# EAGLE design dual.vca.main (EAGLE 9.6.2)
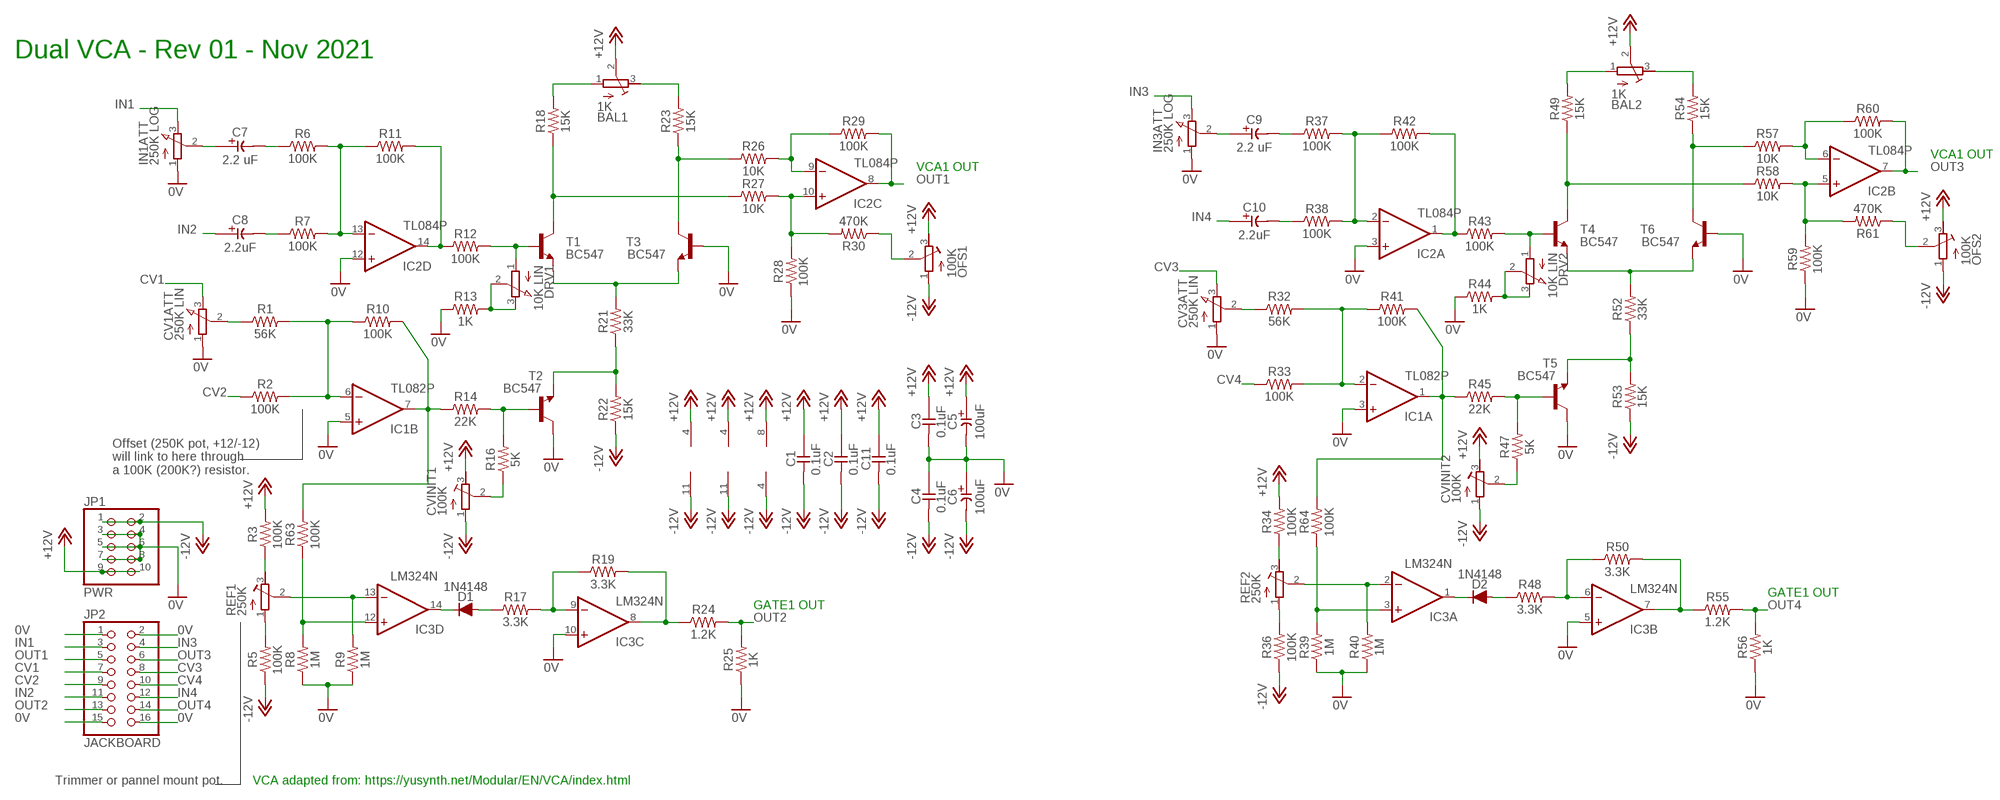
[diagram p0: schematic, sheet 1]

## Parts
BAL1  1K  R-TRIMM3339P  [RTRIM3339P]
BAL2  1K  R-TRIMM3339P  [RTRIM3339P]
C1  0.1uF  CC-US025-024X044  [C025-024X044]
C2  0.1uF  CC-US025-024X044  [C025-024X044]
C3  0.1uF  CC-US025-024X044  [C025-024X044]
C4  0.1uF  CC-US025-024X044  [C025-024X044]
C5  100uF  CE-USE5-8.5  [E5-8,5]
C6  100uF  CE-USE5-8.5  [E5-8,5]
C7  2.2 uF  CE-USE2-5  [E2-5]
C8  2.2uF  CE-USE2-5  [E2-5]
C9  2.2 uF  CE-USE2-5  [E2-5]
C10  2.2uF  CE-USE2-5  [E2-5]
C11  0.1uF  CC-US025-024X044  [C025-024X044]
CV1ATT  250K LIN  3RP/1610N  [3RP/1610N]
CV3ATT  250K LIN  3RP/1610N  [3RP/1610N]
CVINIT1  100K  R-TRIMM3339P  [RTRIM3339P]
CVINIT2  100K  R-TRIMM3339P  [RTRIM3339P]
D1  1N4148  [DO34-5]
D2  1N4148  [DO34-5]
DRV1  10K LIN  3RP/1610N  [3RP/1610N]
DRV2  10K LIN  3RP/1610N  [3RP/1610N]
IC1  TL082P  [DIL08]
IC2  TL084P  [DIL14]
IC3  LM324N  [DIL14]
IN1ATT  250K LOG  3RP/1610N  [3RP/1610N]
IN3ATT  250K LOG  3RP/1610N  [3RP/1610N]
JP1  PWR  PINHD-2X5  [2X05]
JP2  JACKBOARD  PINHD-2X8  [2X08]
OFS1  100K  R-TRIMM3339P  [RTRIM3339P]
OFS2  100K  R-TRIMM3339P  [RTRIM3339P]
R1  56K  R  [0207/7]
R2  100K  R  [0207/7]
R3  100K  R  [0207/7]
R5  100K  R  [0207/7]
R6  100K  R  [0207/7]
R7  100K  R  [0207/7]
R8  1M  R  [0207/7]
R9  1M  R  [0207/7]
R10  100K  R  [0207/7]
R11  100K  R  [0207/7]
R12  100K  R  [0207/7]
R13  1K  R  [0207/7]
R14  22K  R  [0207/7]
R16  5K  R  [0207/7]
R17  3.3K  R  [0207/7]
R18  15K  R  [0207/7]
R19  3.3K  R  [0207/7]
R21  33K  R  [0207/7]
R22  15K  R  [0207/7]
R23  15K  R  [0207/7]
R24  1.2K  R  [0207/7]
R25  1K  R  [0207/7]
R26  10K  R  [0207/7]
R27  10K  R  [0207/7]
R28  100K  R  [0207/7]
R29  100K  R  [0207/7]
R30  470K  R  [0207/7]
R32  56K  R  [0207/7]
R33  100K  R  [0207/7]
R34  100K  R  [0207/7]
R36  100K  R  [0207/7]
R37  100K  R  [0207/7]
R38  100K  R  [0207/7]
R39  1M  R  [0207/7]
R40  1M  R  [0207/7]
R41  100K  R  [0207/7]
R42  100K  R  [0207/7]
R43  100K  R  [0207/7]
R44  1K  R  [0207/7]
R45  22K  R  [0207/7]
R47  5K  R  [0207/7]
R48  3.3K  R  [0207/7]
R49  15K  R  [0207/7]
R50  3.3K  R  [0207/7]
R52  33K  R  [0207/7]
R53  15K  R  [0207/7]
R54  15K  R  [0207/7]
R55  1.2K  R  [0207/7]
R56  1K  R  [0207/7]
R57  10K  R  [0207/7]
R58  10K  R  [0207/7]
R59  100K  R  [0207/7]
R60  100K  R  [0207/7]
R61  470K  R  [0207/7]
R63  100K  R  [0207/7]
R64  100K  R  [0207/7]
REF1  250K  R-TRIMM3339P  [RTRIM3339P]
REF2  250K  R-TRIMM3339P  [RTRIM3339P]
T1  BC547  [TO92]
T2  BC547  [TO92]
T3  BC547  [TO92]
T4  BC547  [TO92]
T5  BC547  [TO92]
T6  BC547  [TO92]

## Nets
0V [pwr]: C3.2 C4.1 C5.- C6.+ CV1ATT.1(A) CV3ATT.1(A) IC1.3(A:+IN) IC1.5(B:+IN) IC2.3(A:+IN) IC2.12(D:+IN) IC3.5(B:+IN) IC3.10(C:+IN) IN1ATT.1(A) IN3ATT.1(A) JP1.3 JP1.4 JP1.5 JP1.6 JP1.7 JP1.8 JP2.1 JP2.2 JP2.15 JP2.16 R8.1 R9.1 R13.1 R25.1 R28.1 R39.1 R40.1 R44.1 R56.1 R59.1 T2.3(C) T3.2(B) T5.3(C) T6.2(B)
+12V [pwr]: BAL1.2(S) BAL2.2(S) C1.1 C2.1 C3.1 C5.+ C11.1 CVINIT1.3(E) CVINIT2.3(E) IC1.8(P:V+) IC2.4(P:V+) IC3.4(P:V+) JP1.9 JP1.10 OFS1.3(E) OFS2.3(E) R3.2 R34.2
-12V [pwr]: C1.2 C2.2 C4.2 C6.- C11.2 CVINIT1.1(A) CVINIT2.1(A) IC1.4(P:V-) IC2.11(P:V-) IC3.11(P:V-) JP1.1 JP1.2 OFS1.1(A) OFS2.1(A) R5.1 R22.1 R36.1 R53.1
CV1: CV1ATT.3(E) JP2.7
CV2: JP2.9 R2.1
CV3: CV3ATT.3(E) JP2.8
CV4: JP2.10 R33.1
IN1: IN1ATT.3(E) JP2.3
IN2: C8.+ JP2.11
IN3: IN3ATT.3(E) JP2.4
IN4: C10.+ JP2.12
N$1: IC2.13(D:-IN) R6.2 R7.2 R11.1
N$2: IC2.9(C:-IN) R26.2 R29.1
N$3: IC2.14(D:OUT) R11.2 R12.1
N$4: DRV1.1(A) R12.2 T1.2(B)
N$5: R18.1 R27.1 T1.3(C)
N$6: BAL1.1(A) R18.2
N$7: BAL1.3(E) R23.2
N$8: R23.1 R26.1 T3.3(C)
N$9: R21.2 T1.1(E) T3.1(E)
N$10: OFS1.2(S) R30.1
N$11: C7.- R6.1
N$12: IC2.10(C:+IN) R27.2 R28.2 R30.2
N$13: R21.1 R22.2 T2.1(E)
N$14: C8.- R7.1
N$15: R14.2 R16.2 T2.2(B)
N$16: CVINIT1.2(S) R16.1
N$17: IC1.7(B:OUT) R10.2 R14.1 R63.2
N$18: IC3.13(D:-IN) R9.2 REF1.2(S)
N$19: IC1.6(B:-IN) R1.2 R2.2 R10.1
N$20: R3.1 REF1.3(E)
N$21: R5.2 REF1.1(A)
N$22: D1.C IC3.14(D:OUT)
N$23: D1.A R17.1
N$24: IC3.9(C:-IN) R17.2 R19.1
N$25: IC3.8(C:OUT) R19.2 R24.1
N$26: DRV2.2(S) DRV2.3(E) R44.2
N$27: C7.+ IN1ATT.2(S)
N$28: IC2.2(A:-IN) R37.2 R38.2 R42.1
N$29: CV1ATT.2(S) R1.1
N$30: IC2.1(A:OUT) R42.2 R43.1
N$31: R49.1 R58.1 T4.3(C)
N$32: BAL2.1(A) R49.2
N$33: BAL2.3(E) R54.2
N$34: R54.1 R57.1 T6.3(C)
N$35: R52.2 T4.1(E) T6.1(E)
N$36: IC2.6(B:-IN) R57.2 R60.1
N$37: IC2.5(B:+IN) R58.2 R59.2 R61.2
N$38: OFS2.2(S) R61.1
N$39: R52.1 R53.2 T5.1(E)
N$40: R45.2 R47.2 T5.2(B)
N$41: CVINIT2.2(S) R47.1
N$42: IC1.1(A:OUT) R41.2 R45.1 R64.2
N$43: IC1.2(A:-IN) R32.2 R33.2 R41.1
N$44: C9.- R37.1
N$45: C10.- R38.1
N$46: IC3.3(A:+IN) R39.2 R64.1
N$47: R34.1 REF2.3(E)
N$48: R36.2 REF2.1(A)
N$49: D2.C IC3.1(A:OUT)
N$50: D2.A R48.1
N$51: IC3.6(B:-IN) R48.2 R50.1
N$52: IC3.7(B:OUT) R50.2 R55.1
N$53: DRV2.1(A) R43.2 T4.2(B)
N$54: DRV1.2(S) DRV1.3(E) R13.2
N$55: C9.+ IN3ATT.2(S)
N$56: CV3ATT.2(S) R32.1
N$57: IC3.12(D:+IN) R8.2 R63.1
N$58: IC3.2(A:-IN) R40.2 REF2.2(S)
OUT1: IC2.8(C:OUT) JP2.5 R29.2
OUT2: JP2.13 R24.2 R25.2
OUT3: IC2.7(B:OUT) JP2.6 R60.2
OUT4: JP2.14 R55.2 R56.2

## Notes on the sheet
- Dual VCA - Rev 01 - Nov 2021
- VCA1 OUT
- VCA1 OUT
- Offset (250K pot, +12/-12)
  will link to here through 
  a 100K (200K?) resistor.
- GATE1 OUT
- GATE1 OUT
- Trimmer or pannel mount pot. | VCA adapted from: https://yusynth.net/Modular/EN/VCA/index.html

## Library data of the parts
BAL1 BAL2 CVINIT1 CVINIT2 OFS1 OFS2 REF1 REF2 = rcl:R-TRIMM: Trimm resistor; SPICEMODEL: X; SPICEPREFIXL: POT
C1-C4 C11 = _common:CC-US: CAPACITOR, US symbol
C5-C10 = _common:CE-US: ELECTROLYTIC CAPACITOR, US symbol
CV1ATT CV3ATT DRV1 DRV2 IN1ATT IN3ATT = _common:3RP/1610N: Generic single level pcb pot.
D1 D2 = _common:1N4148: DIODE high speed (Philips)
IC1 = linear:TL082: OP AMP Data sheet <http://www.ti.com/lit/ds/symlink/tl084a . pdf>; DATA_SHEET: <a href="http://www.ti.com/lit/ds/symlink/tl084a.pdf"> Data sheet </a>
IC2 = linear:TL084: OP AMP
IC3 = linear:LM324: OP AMP
JP1 = pinhead:PINHD-2X5: PIN HEADER
JP2 = pinhead:PINHD-2X8: PIN HEADER
R1-R3 R5-R14 R16-R19 R21-R30 R32-R34 R36-R45 R47-R50 R52-R61 R63 R64 = _common:R: RESISTOR, US symbol
T1-T6 = transistor:BC547: NPN TRANSISTOR

## Net classes
0 default: width 0.406 mm, clearance 0.305 mm
1 pwr: width 0.813 mm, clearance 0.406 mm to class 0, clearance 0.406 mm

## Board
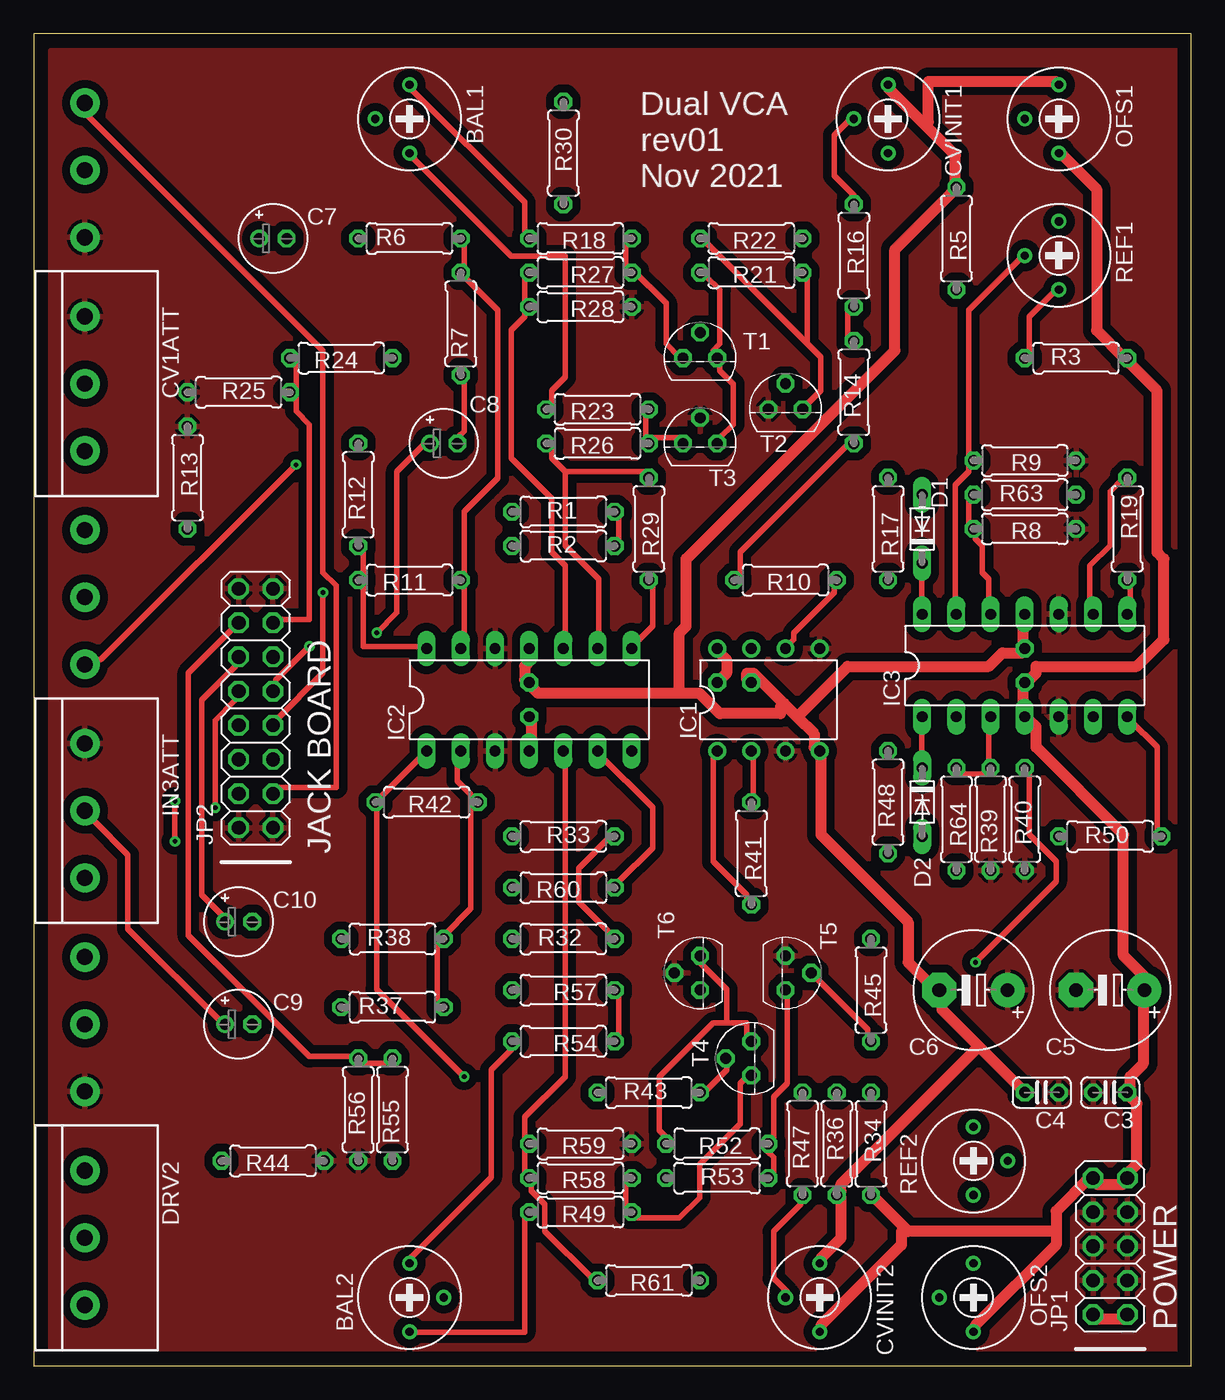
[diagram p1: board, top side]
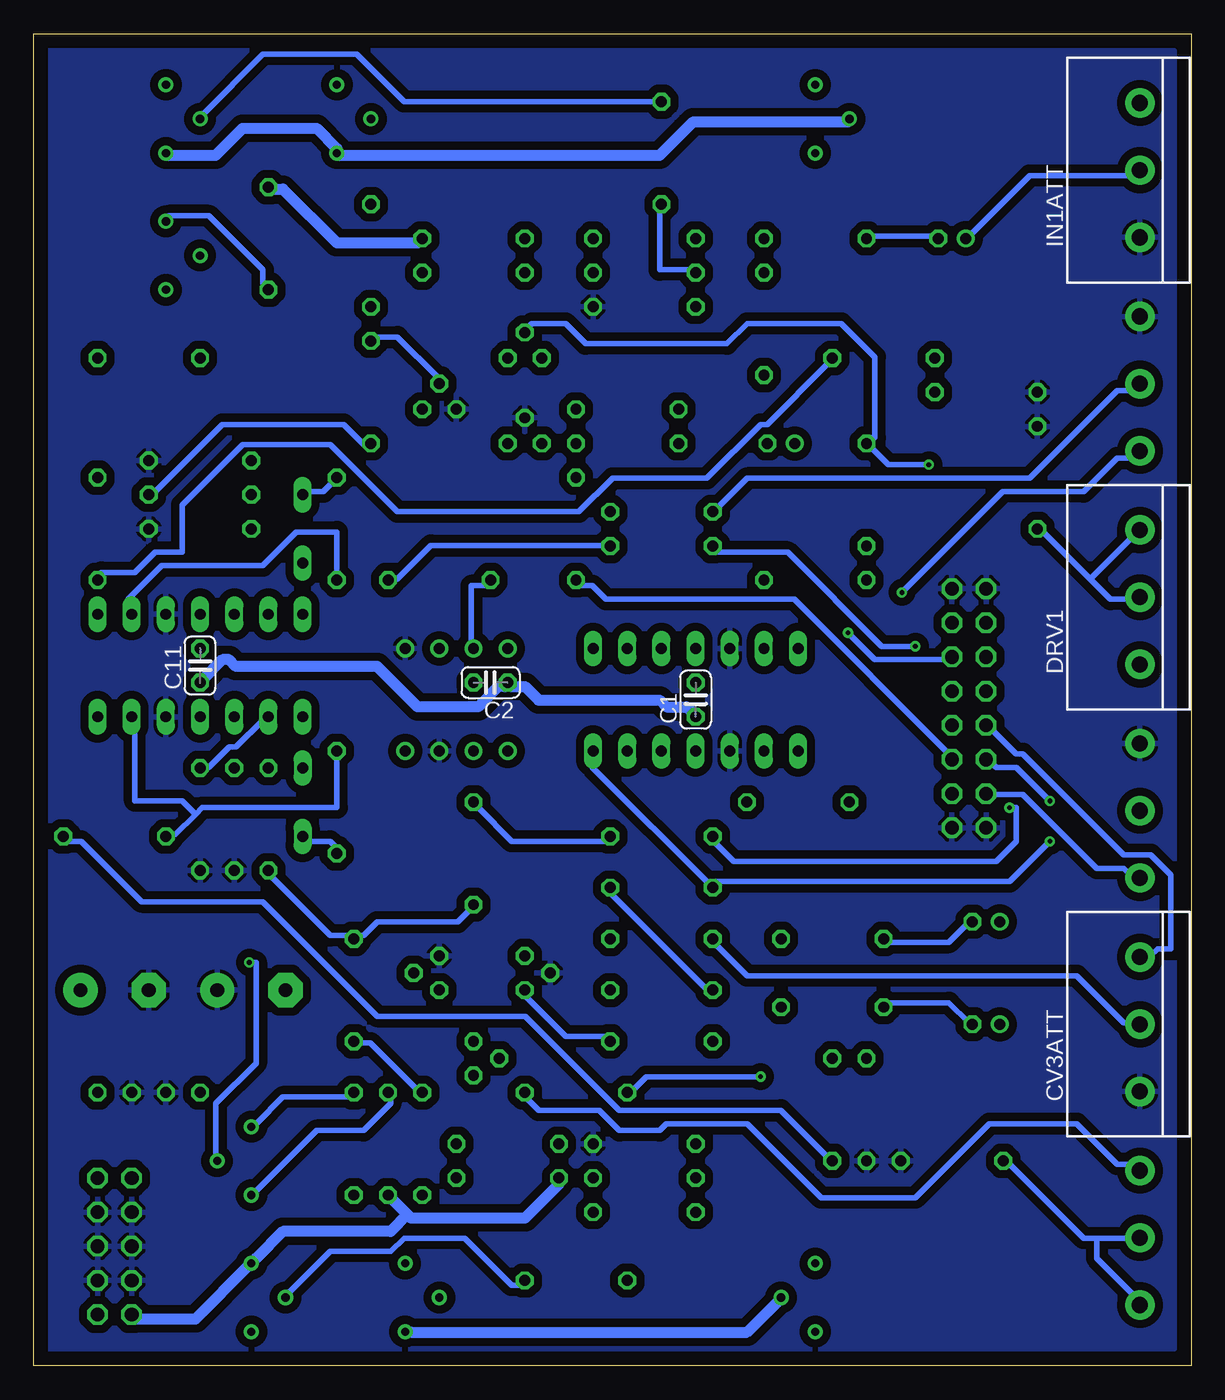
[diagram p2: board, bottom side, seen from below]

Size 86.03 x 99.05 mm. Coordinates in mm from the lower left corner, seen from the top.
Outline: 0,0 86.03,0 86.03,99.05 0,99.05 0,0
Copper layers (1*16): Top 0.035mm / dielectric 1.5mm / Bottom 0.035mm
Design rules "default": minimum track width 6mil, minimum drill 0.35mm, track to track 6mil, track to pad 6mil, pad to pad 6mil, via to via 6mil, smd to smd 6mil, copper to edge 40mil, drill to drill 6mil, minimum pad ring 10mil, minimum via ring 8mil, stop-mask expansion 4mil, vias tented up to drill 0mil, thermal gap 10mil

### Footprints (pad centres in the part's own frame; a part is rotated, then mirrored left to right if it is on the bottom)
RTRIM3339P = drill 0.61: 1 -2.54,0; 2 0,-2.54; 3 2.54,0
C025-024X044 = drill 0.813 octagon: 1 -1.27,0; 2 1.27,0
E5-8,5 = drill 1.016 pad 2.54: + -2.54,0 | drill 1.016 pad 2.54 octagon: - 2.54,0
E2-5 = drill 0.813 pad 1.27: + -1.016,0 | drill 0.813 pad 1.27 octagon: - 1.016,0
3RP/1610N = drill 1.2 pad 2.184: 1 -5,0; 2 0,0; 3 5,0
DO34-5 = drill 0.813 long: A 2.54,0; C -2.54,0
DIL08 = drill 0.813 pad 1.27: 1 -3.81,-3.81; 2 -1.27,-3.81; 3 1.27,-3.81; 4 3.81,-3.81; 5 3.81,3.81; 6 1.27,3.81; 7 -1.27,3.81; 8 -3.81,3.81
DIL14 = drill 0.813 long: 1 -7.62,-3.81; 2 -5.08,-3.81; 3 -2.54,-3.81; 4 0,-3.81; 5 2.54,-3.81; 6 5.08,-3.81; 7 7.62,-3.81; 8 7.62,3.81; 9 5.08,3.81; 10 2.54,3.81; 11 0,3.81; 12 -2.54,3.81; 13 -5.08,3.81; 14 -7.62,3.81
2X05 = drill 1.016 octagon: 1 -5.08,-1.27; 2 -5.08,1.27; 3 -2.54,-1.27; 4 -2.54,1.27; 5 0,-1.27; 6 0,1.27; 7 2.54,-1.27; 8 2.54,1.27; 9 5.08,-1.27; 10 5.08,1.27
2X08 = drill 1.016 octagon: 1 -8.89,-1.27; 2 -8.89,1.27; 3 -6.35,-1.27; 4 -6.35,1.27; 5 -3.81,-1.27; 6 -3.81,1.27; 7 -1.27,-1.27; 8 -1.27,1.27; 9 1.27,-1.27; 10 1.27,1.27; 11 3.81,-1.27; 12 3.81,1.27; 13 6.35,-1.27; 14 6.35,1.27; 15 8.89,-1.27; 16 8.89,1.27
0207/7 = drill 0.813 octagon: 1 -3.81,0; 2 3.81,0
TO92 = drill 0.813 octagon: 1 1.27,0; 2 0,1.905; 3 -1.27,0

### Placement (x,y rotation side)
BAL1  27.94,92.71 270 top
BAL2  27.94,5.08 90 top
C1  36.83,49.53 90 bottom
C2  52.07,50.8 180 bottom
C3  80.01,20.32 180 top
C4  74.93,20.32 180 top
C5  80.01,27.94 180 top
C6  69.85,27.94 180 top
C7  17.78,83.82 0 top
C8  30.48,68.58 0 top
C9  15.24,25.4 0 top
C10  15.24,33.02 0 top
C11  73.66,52.07 90 bottom
CV1ATT  3.81,73.03 270 top
CV3ATT  3.81,25.4 90 bottom
CVINIT1  63.5,92.71 270 top
CVINIT2  58.42,5.08 270 top
D1  66.04,62.23 90 top
D2  66.04,41.91 270 top
DRV1  3.81,57.15 90 bottom
DRV2  3.81,9.53 270 top
IC1  54.61,49.53 0 top
IC2  36.83,49.53 0 top
IC3  73.66,52.07 0 top
IN1ATT  3.81,88.9 90 bottom
IN3ATT  3.81,41.27 270 top
JP1  80.01,8.89 90 top
JP2  16.51,48.9 90 top
OFS1  76.2,92.71 270 top
OFS2  69.85,5.08 270 top
R1  39.37,63.5 0 top
R2  39.37,60.96 0 top
R3  77.47,74.93 0 top
R5  68.58,83.82 270 top
R6  27.94,83.82 0 top
R7  31.75,77.47 90 top
R8  73.66,62.23 180 top
R9  73.66,67.31 180 top
R10  55.88,58.42 180 top
R11  27.94,58.42 180 top
R12  24.13,64.77 90 top
R13  11.43,66.04 270 top
R14  60.96,72.39 90 top
R16  60.96,82.55 270 top
R17  63.5,62.23 270 top
R18  40.64,83.82 180 top
R19  81.28,62.23 270 top
R21  53.34,81.28 180 top
R22  53.34,83.82 180 top
R23  41.91,71.12 180 top
R24  22.86,74.93 180 top
R25  15.24,72.39 0 top
R26  41.91,68.58 180 top
R27  40.64,81.28 180 top
R28  40.64,78.74 180 top
R29  45.72,62.23 270 top
R30  39.37,90.17 270 top
R32  39.37,31.75 0 top
R33  39.37,39.37 0 top
R34  62.23,16.51 270 top
R36  59.69,16.51 90 top
R37  26.67,26.67 0 top
R38  26.67,31.75 0 top
R39  71.12,40.64 90 top
R40  73.66,40.64 90 top
R41  53.34,38.1 270 top
R42  29.21,41.91 180 top
R43  45.72,20.32 0 top
R44  17.78,15.24 180 top
R45  62.23,27.94 270 top
R47  57.15,16.51 90 top
R48  63.5,41.91 90 top
R49  40.64,11.43 180 top
R50  80.01,39.37 0 top
R52  50.8,16.51 180 top
R53  50.8,13.97 0 top
R54  39.37,24.13 180 top
R55  26.67,19.05 90 top
R56  24.13,19.05 90 top
R57  39.37,27.94 180 top
R58  40.64,13.97 180 top
R59  40.64,16.51 180 top
R60  39.37,35.56 180 top
R61  45.72,6.35 180 top
R63  73.66,64.77 0 top
R64  68.58,40.64 270 top
REF1  76.2,82.55 270 top
REF2  69.85,15.24 90 top
T1  49.53,74.93 0 top
T2  55.88,71.12 0 top
T3  49.53,68.58 0 top
T4  53.34,22.86 90 top
T5  55.88,29.21 270 top
T6  49.53,29.21 90 top

### Tracks (layer width: path | path; a pad name or v marks a point on that pad's centre or on a via)
0V
  pour Top (isolate 0.61): 1.27,97.79 85.09,97.79 85.09,1.27 1.27,1.27
  pour Bottom (isolate 0.61): 1.27,97.79 85.09,97.79 85.09,1.27 1.27,1.27
+12V
  Top 0.813: OFS1.3 76.5,90 79,87.5 79,77 81,75 R3.2 81.5,74.5 83.5,72.5 83.5,60.5 84,60 84,54 82,52 74.5,52 74.5,51.5 74,51 C11.1 73.5,50.5 73.5,48.5 IC3.4 74,48 74.5,47.5 74.5,46 81,39.5 81,30.5 82.5,29 82.5,28 C5.+ 82.5,27.5 82.5,22.5 81.5,21.5 81.5,20.5 C3.1 81.5,20 82,19.5 82,15 81.5,14.5 81.5,14 JP1.9 81,13.5 79,13.5 JP1.10 78.5,14 76,11.5 76,10 | IC2.4 37,46 37,48 C1.1 | C2.1 51.5,51.5 51.5,52.5 51,53 IC1.8 | 76,10 76,9 70,3 OFS2.3 | 64.75,10.25 65,10 76,10 | 64.75,10.25 62.5,12.5 R34.2 | CVINIT2.3 58.5,3 64.5,9 64.5,10 64.75,10.25
  Bottom 0.813: OFS1.3 76,90 72.5,90 70.5,92 65,92 63.5,90.5 CVINIT1.3 63.5,90 39.5,90 37,92.5 25.5,92.5 BAL1.2 | C1.1 37,48.5 37.5,49 39,49 39.5,49.5 48.5,49.5 49.5,50.5 50.5,50.5 C2.1 51,50.5 51.5,50.5 53,49 57.5,49 60.5,52 71,52 71.5,52.5 72,52.5 73.5,51 C11.1 | BAL2.2 30.5,5 33,2.5 58,2.5 CVINIT2.3
-12V
  Top 0.813: 70.25,23.75 67.5,26.5 67.5,27.5 C6.- 67,28 65,30 65,33 58.5,39.5 58.5,45.5 IC1.4 58,46 58,47 56.75,48.25 | 70.25,23.75 73.5,20.5 C4.2 | JP1.1 81,3.5 79,3.5 JP1.2 | CVINIT2.1 58.5,8 60,9.5 60,12.5 R36.1 60,13 60,13.5 70.25,23.75 | 66.25,92.25 68.5,90 68.5,88 R5.1 68.5,87.5 64,83 64,75.5 48.5,60 48.5,55 48,54.5 48,50 | 66.25,92.25 63.5,95 CVINIT1.1 | OFS1.1 76,95.5 66.5,95.5 66.5,92.5 66.25,92.25 | IC3.11 73.5,55.5 73.5,53.5 C11.2 73.5,53 72,53 71,52 60.5,52 56.75,48.25 | IC2.11 37,53 37,52.5 36.5,52 36.5,51 C1.2 37,50.5 37.5,50 48,50 | 55.75,49.25 53.5,51.5 53,51.5 53,51 C2.2 | 55.75,49.25 56.75,48.25 | 48,50 49.5,50 51,48.5 55.5,48.5 55.5,49 55.75,49.25
  Bottom 0.813: JP1.2 78.5,3.5 74,3.5 70,7.5 OFS2.1 69.5,8 67.5,10 59.5,10 58.25,11.25 | 58.25,11.25 59.5,12.5 R36.1 | 58.25,11.25 58,11 49.5,11 47,13.5 R53.1 | R22.1 57.5,83.5 63.5,83.5 67.5,87.5 68.5,87.5 R5.1
CV1  (via drill 0.35)
  Top 0.406: v21.5,57.5 21.5,51.5 18,48 JP2.7
  Bottom 0.406: v21.5,57.5 14,65 8,65 5.5,67.5 4.5,67.5 4,68 CV1ATT.3
CV2  (via drill 0.35)
  Top 0.406: v20.5,53.5 18,51 18,50.5 JP2.9
  Bottom 0.406: v20.5,53.5 23,53.5 30,60.5 35.5,60.5 R2.1
CV3
  Bottom 0.406: JP2.8 15,47.5 13,45.5 12.5,45.5 5,38 3,38 1.5,36.5 1.5,31 2.5,31 3,30.5 3.5,30.5 CV3ATT.3
CV4  (via drill 0.35)
  Top 0.406: v13.5,41.5 13.5,48 15,49.5 15,50 JP2.10
  Bottom 0.406: v13.5,41.5 13,41.5 13,39 14.5,37.5 34,37.5 35.5,39 R33.1
IN1
  Top 0.406: JP2.3 18,43 22.5,43 22.5,58 21.5,59 21.5,75.5 4,93 4,93.5 IN1ATT.3
IN2  (via drill 0.35)
  Top 0.406: v25.5,54.5 27,56 27,66.5 29,68.5 C8.+
  Bottom 0.406: v25.5,54.5 23.5,52.5 18,52.5 JP2.11
IN3
  Bottom 0.406: JP2.4 15,42.5 12.5,42.5 7,37 5,37 4.5,36.5 4,36.5 IN3ATT.3
IN4
  Top 0.406: C10.+ 14,33.5 12.5,35 12.5,49.5 15,52 15,52.5 JP2.12
N$1
  Top 0.406: R6.2 32,83.5 32,81.5 R7.2 32,81 34.5,78.5 34.5,66 32,63.5 32,58.5 R11.1 32,58 32,53.5 IC2.13
N$2
  Top 0.406: 39.5,66.5 39.5,61 42,58.5 42,53.5 IC2.9 | 39.5,66.5 38.5,67.5 38.5,68.5 R26.2 | 39.5,66.5 45.5,66.5 R29.1
N$3
  Top 0.406: R12.1 24.5,60.5 24.5,58.5 R11.2 24.5,58 24.5,53.5 29,53.5 IC2.14
N$4  (via drill 0.35)
  Top 0.406: v19.5,67 5,52.5 4,52.5 DRV1.1
  Bottom 0.406: v19.5,67 22.5,67 24,68.5 R12.2 24,69 23.5,69 23.5,75 26,77.5 33,77.5 34.5,76 45,76 46.5,77.5 49,77.5 49.5,77 T1.2
N$5
  Top 0.406: R18.1 44,83.5 44,81.5 R27.1 44.5,81.5 47,79 47,76 48,75 T1.3
N$6
  Top 0.406: BAL1.1 28,95 36.5,86.5 36.5,84 R18.2
N$7
  Top 0.406: BAL1.3 28,90 35.5,82.5 39.5,82.5 39.5,73.5 38.5,72.5 38.5,71.5 R23.2
N$8
  Top 0.406: R23.1 45.5,71 45.5,69 R26.1 46,69 48,69 T3.3
N$9
  Top 0.406: T3.1 51,69 52,70 52,73 51,74 51,74.5 T1.1 50.5,75 50.5,75.5 51,76 51,80 50,81 R21.2
N$10
  Bottom 0.406: OFS1.2 73.5,93 69,97.5 62,97.5 58.5,94 39.5,94 R30.1
N$11
  Bottom 0.406: C7.- 19,84 24,84 R6.1
N$12
  Top 0.406: R27.2 36.5,81 36.5,79 R28.2 36.5,78.5 36.5,78 35.5,77 35.5,67.5 38.5,64.5 38.5,60.5 39.5,59.5 39.5,53.5 IC2.10
  Bottom 0.406: R30.2 39.5,86 39.5,81.5 37,81.5 R27.2
N$13
  Top 0.406: 57.5,76 58.5,75 58.5,72.5 57.5,71.5 T2.1 | 57.5,76 57.5,81 R21.1 | 57.5,76 50,83.5 R22.2
N$14
  Top 0.406: C8.- 31.5,69 32,69.5 32,73.5 R7.1
N$15
  Top 0.406: R16.2 60.5,78.5 60.5,76.5 R14.2
  Bottom 0.406: T2.2 56,73.5 59,76.5 60.5,76.5 R14.2
N$16
  Top 0.406: CVINIT1.2 60.5,92.5 59.5,91.5 59.5,88.5 61,87 61,86.5 R16.1
N$17
  Top 0.406: R14.1 60.5,68.5 52.5,60.5 52.5,58.5 R10.2
  Bottom 0.406: IC1.7 53.5,53.5 53.5,58 52.5,58 R10.2 | R63.2 77,65 72,70 63,70 61.5,68.5 61,68.5 R14.1
N$18
  Top 0.406: REF1.2 73.5,82.5 69.5,78.5 69.5,67.5 R9.2 69.5,67 69.5,66.5 68.5,65.5 68.5,56 IC3.13
N$19
  Top 0.406: R2.2 43.5,61 43.5,63.5 R1.2 | IC1.6 56,53.5 56.5,54 56.5,54.5 59.5,57.5 59.5,58 R10.1
  Bottom 0.406: R2.2 43.5,61 56.5,61 59,58.5 59.5,58.5 R10.1
N$20
  Top 0.406: REF1.3 76,80 74,78 74,75 R3.1
N$21
  Bottom 0.406: REF1.1 76,85.5 73,85.5 69,81.5 69,80.5 R5.2
N$22
  Top 0.406: IC3.14 66,56 66,59.5 D1.C
N$23
  Bottom 0.406: R17.1 63.5,66 64.5,65 66,65 D1.A
N$24
  Top 0.406: R19.1 81,66 80,65 80,61 78.5,59.5 78.5,56 IC3.9
  Bottom 0.406: R17.2 63.5,62 66.5,62 69,59.5 76.5,59.5 79,57 79,56 IC3.9
N$25
  Top 0.406: IC3.8 81.5,56 81.5,58 R19.2
  Bottom 0.406: R24.1 27,74.5 31.5,70 32,70 36,66 43,66 45.5,63.5 59,63.5 64,68.5 70.5,68.5 75,64 75,60.5 77,60.5 78.5,59 81,59 81.5,58.5 R19.2
N$26
  Bottom 0.406: 7,9.5 4,9.5 DRV2.2 | 7,9.5 8,9.5 13.5,15 R44.2 | 7,9.5 7,8 4,5 DRV2.3
N$27
  Bottom 0.406: C7.+ 16.5,84 12,88.5 4,88.5 IN1ATT.2
N$28
  Top 0.406: R37.2 30,27 30,31.5 R38.2 30.5,32 32.5,34 32.5,42.5 | 32.5,42.5 31.5,43.5 31.5,45.5 IC2.2 | 32.5,42.5 33,42 R42.1
N$29
  Bottom 0.406: R1.1 35.5,63.5 33,66 12,66 5.5,72.5 4.5,72.5 4,73 CV1ATT.2
N$30  (via drill 0.35)
  Top 0.406: v32,21.5 25.5,28 25.5,41.5 R42.2 25.5,42 29,45.5 IC2.1
  Bottom 0.406: v32,21.5 40.5,21.5 41.5,20.5 R43.1
N$31
  Top 0.406: R58.1 44,13.5 44,11.5 R49.1 44.5,11 48,11 49.5,12.5 49.5,15 52.5,18 52.5,21 53,21.5 T4.3
N$32
  Top 0.406: BAL2.1 28,2.5 36.5,2.5 36.5,11 R49.2
N$33
  Top 0.406: BAL2.3 28,8 34,14 34,22 35.5,23.5 35.5,24 R54.2
N$34
  Top 0.406: R54.1 43.5,24.5 43.5,27.5 R57.1
  Bottom 0.406: T6.3 49.5,27.5 46.5,24.5 43.5,24.5 R54.1
N$35
  Top 0.406: 51.5,25.5 53,25.5 53,24.5 T4.1 | 51.5,25.5 50.5,25.5 46.5,21.5 46.5,17.5 47,17 R52.2 | 51.5,25.5 51.5,28 49.5,30 T6.1
N$36
  Top 0.406: IC2.6 42,45.5 46,41.5 46,38.5 43.5,36 R60.1
  Bottom 0.406: R57.2 36,28 43.5,35.5 R60.1
N$37
  Top 0.406: R61.2 41.5,6.5 38,10 38,12 37,13 37,13.5 R58.2 36.5,14 36.5,16.5 R59.2 36.5,17 36.5,18.5 39.5,21.5 39.5,45.5 IC2.5
N$38
  Bottom 0.406: OFS2.2 67,5.5 64,8.5 59.5,8.5 58.5,9.5 54,9.5 50.5,6 50,6 R61.1
N$39
  Top 0.406: R53.2 55,14 55,15.5 54.5,16 54.5,16.5 R52.1 55,17 55,20 56,21 56,27.5 T5.1
N$40
  Top 0.406: T5.2 58,29 62,25 62,24.5 R45.2
  Bottom 0.406: R47.2 57.5,20.5 61,24 62,24 R45.2
N$41
  Top 0.406: CVINIT2.2 56,5.5 55,6.5 55,10 57,12 57,12.5 R47.1
N$42
  Top 0.406: IC1.1 50.5,45.5 50.5,37.5 53,35 53,34.5 R41.2
  Bottom 0.406: R41.2 53.5,34 54.5,33 60.5,33 61.5,32 62,32 R45.1 62.5,32 64,32 68.5,36.5 R64.2
N$43
  Top 0.406: R41.1 53.5,42 53.5,45.5 IC1.2 | R32.2 43,32 40.5,34.5 40.5,37 43,39.5 R33.2
  Bottom 0.406: R41.1 53,41.5 50.5,39 43.5,39 R33.2
N$44
  Bottom 0.406: C9.- 16.5,25.5 18,27 22.5,27 R37.1
N$45
  Bottom 0.406: C10.- 16.5,33 18,31.5 22.5,31.5 R38.1
N$46
  Top 0.406: R64.1 69,44 71,44 R39.2 71,44.5 71,48 IC3.3
N$47
  Bottom 0.406: REF2.3 69.5,18 67.5,20 62.5,20 R34.1
N$48
  Bottom 0.406: REF2.1 69.5,13 65,17.5 61.5,17.5 59.5,19.5 59.5,20 R36.2
N$49
  Top 0.406: D2.C 66,44.5 66,48 IC3.1
N$50
  Bottom 0.406: R48.1 63.5,38.5 64,39 66,39 D2.A
N$51
  Bottom 0.406: R48.2 63.5,41.5 73.5,41.5 74,41 | 74,41 75.5,39.5 76,39.5 R50.1 | 74,41 75,42 78.5,42 78.5,48 IC3.6
N$52
  Top 0.406: IC3.7 81.5,48 83.5,46 83.5,39.5 R50.2
  Bottom 0.406: R55.1 27,15.5 30.5,19 42.5,19 49.5,26 60.5,26 69,34.5 78,34.5 82.5,39 83.5,39 R50.2
N$53
  Top 0.406: R43.2 50,20.5 51.5,22 51.5,22.5 T4.2
  Bottom 0.406: R43.2 49.5,20 48.5,19 44,19 42.5,17.5 39.5,17.5 39,18 33,18 27.5,12.5 20.5,12.5 15,18 8.5,18 5.5,15 4,15 DRV2.1
N$54
  Bottom 0.406: 7.5,58.5 6,57 4,57 DRV1.2 | 7.5,58.5 11,62 R13.2 | 7.5,58.5 4,62 DRV1.3
N$55
  Top 0.406: C9.+ 14,25.5 7,32.5 7,38 4.5,40.5 4,40.5 4,41 IN3ATT.2
N$56
  Bottom 0.406: R32.1 35.5,31.5 33,29 8.5,29 5,25.5 4,25.5 CV3ATT.2
N$57
  Top 0.406: R63.1 69.5,64.5 69.5,62.5 R8.2 70,62 70,61.5 70.5,61 70.5,59 71,58.5 71,56 IC3.12
N$58  (via drill 0.35)
  Top 0.406: v70,30 76,36 76,37.5 74,39.5 74,44 R40.2
  Bottom 0.406: v70,30 69.5,30 69.5,22.5 72.5,19.5 72.5,15.5 REF2.2 | IC3.2 69,48 71,46 71.5,46 73,44.5 73.5,44.5 R40.2
OUT1
  Top 0.406: IC2.8 44.5,53.5 46,55 46,58 R29.2
  Bottom 0.406: JP2.5 18,45.5 29.5,57 43.5,57 44.5,58 45.5,58 R29.2
OUT2
  Top 0.406: R24.2 19.5,74.5 19.5,72.5 R25.2 19.5,72 19.5,71 20.5,70 20.5,55.5 18,55.5 JP2.13
OUT3  (via drill 0.35)
  Top 0.406: v10.5,39 v10.5,42
  Bottom 0.406: IC2.7 44.5,45.5 44.5,44.5 R60.2 35.5,36 13.5,36 v10.5,39 | v10.5,42 13,44.5 14.5,44.5 15,45 JP2.6
OUT4
  Top 0.406: R55.2 26.5,22.5 24.5,22.5 R56.2 24,23 20.5,23 11.5,32 11.5,51.5 15,55 JP2.14

### Text on the board
tNames: Dual VCA / rev01 / Nov 2021 | JACK BOARD | POWER